# Altium schematic sheet Plugs.SchDoc
size A4
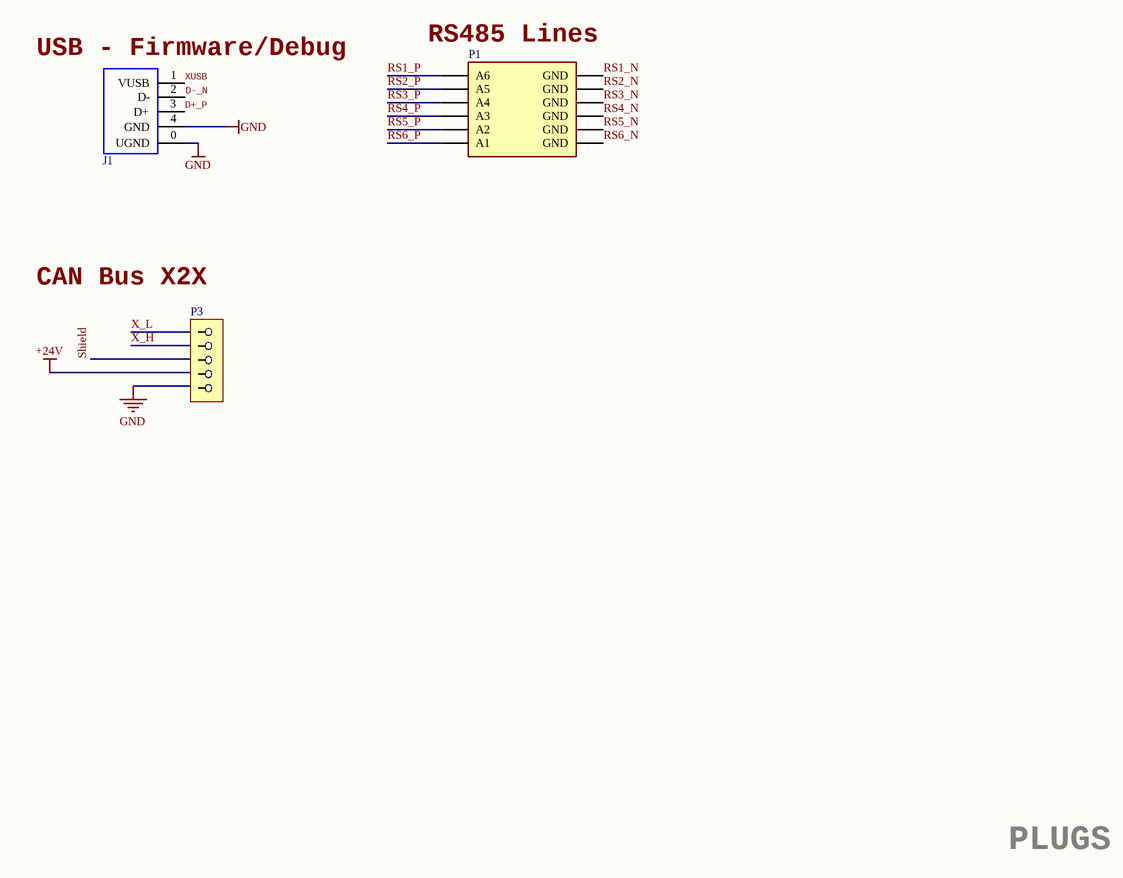
[diagram p0: Plugs.SchDoc]

## Parts
J1  (no value)  [USB B]
P1  (no value)  [mcd 1,5/6-G1-3.81]
P3  (no value)  [PhClass5]

## Nets
+24V: P3.4
GND: J1.0(UGND) J1.4(GND) P3.5
D+_P: J1.3(D+)
D-_N: J1.2(D-)
RS1_N: P1.2(GND)
RS1_P: P1.1(A6)
RS2_N: P1.4(GND)
RS2_P: P1.3(A5)
RS3_N: P1.6(GND)
RS3_P: P1.5(A4)
RS4_N: P1.8(GND)
RS4_P: P1.7(A3)
RS5_N: P1.10(GND)
RS5_P: P1.9(A2)
RS6_N: P1.12(GND)
RS6_P: P1.11(A1)
Shield: P3.3
X_H: P3.2
X_L: P3.1
XUSB: J1.1(VUSB)

## Notes on the sheet
- (near J1) USB - Firmware/Debug
- (near P1) RS485 Lines
- (near P3) CAN Bus X2X
- PLUGS

## Library data of the parts
J1 = USBB-1J: Part Description: USB B Socket; Part Number: USBB-1J
P1 = Header 6X2: Part Description: PCB Header, 6-Pin, Dual row; Part Number: MCD 1.5/6-G1-3.81
P3 = EMSTBA 2.5/5-G-5.08: Part Description: PCB header; Part Number: EMSTBA 2.5/5-G-5.08